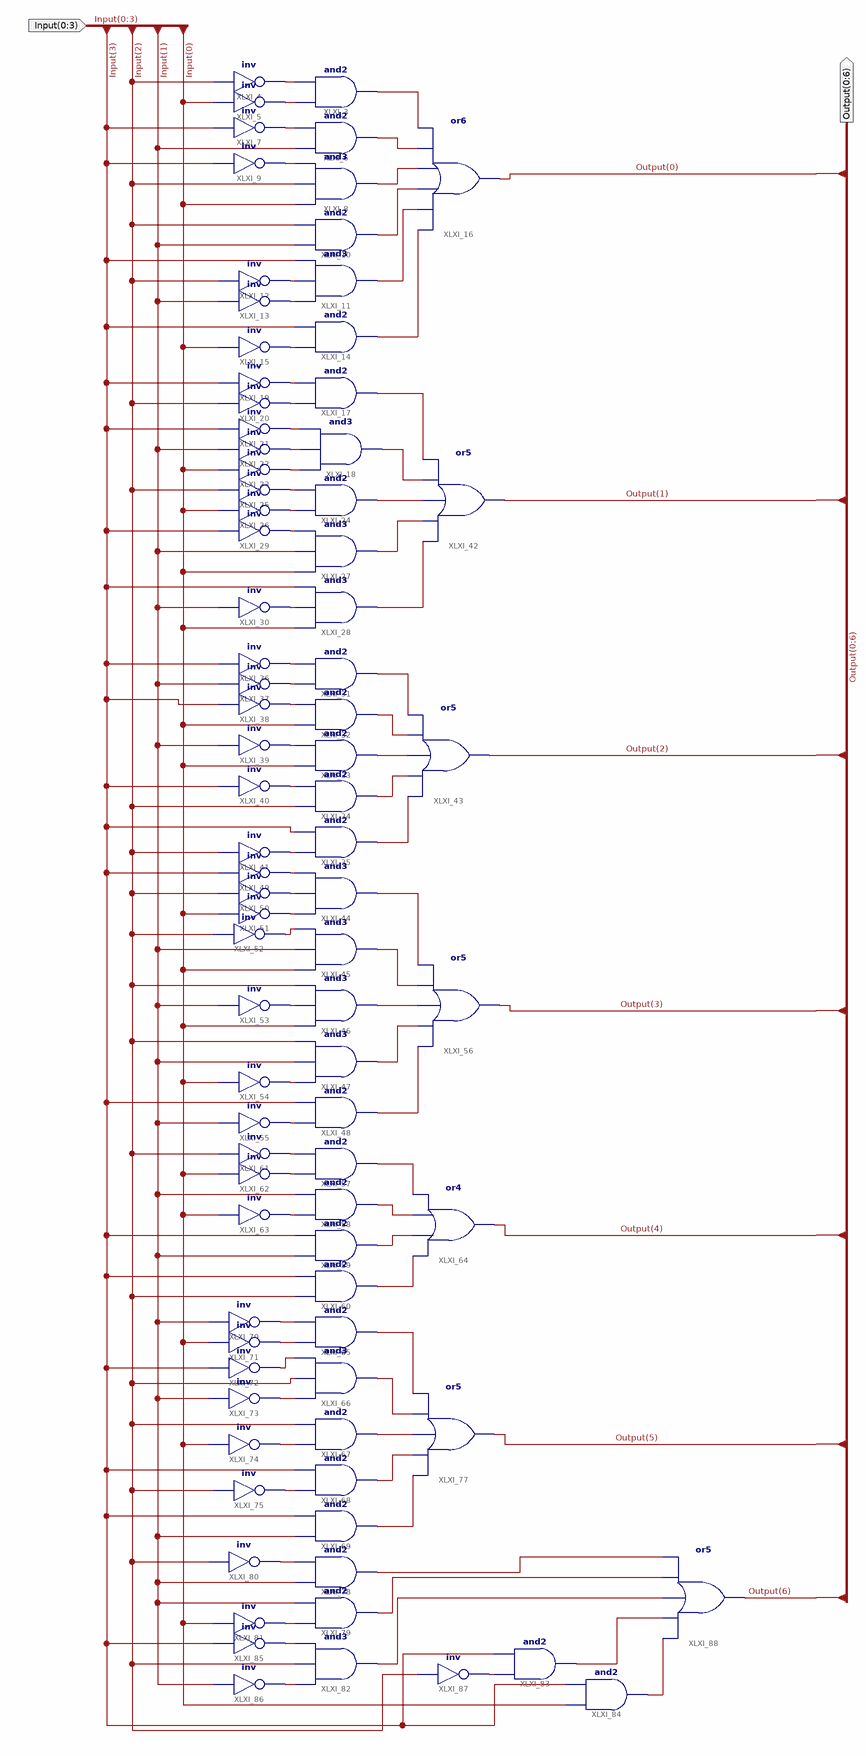
[diagram p0: schematic sheet 1]
// Xilinx ISE schematic decodeTosegment.sch (spartan6) as structural Verilog: 85 symbols, 2 ports
module decodeTosegment (
  input  [0:3] Input,
  output [0:6] Output
);

  wire XLXN_14, XLXN_15, XLXN_16, XLXN_17, XLXN_18, XLXN_19, XLXN_20, XLXN_21, XLXN_22, XLXN_23, XLXN_24,
       XLXN_25, XLXN_26, XLXN_27, XLXN_28, XLXN_29, XLXN_30, XLXN_31, XLXN_33, XLXN_34, XLXN_35, XLXN_36,
       XLXN_37, XLXN_38, XLXN_39, XLXN_40, XLXN_41, XLXN_43, XLXN_44, XLXN_45, XLXN_46, XLXN_47, XLXN_49,
       XLXN_50, XLXN_51, XLXN_52, XLXN_53, XLXN_54, XLXN_55, XLXN_56, XLXN_57, XLXN_58, XLXN_59, XLXN_60,
       XLXN_62, XLXN_63, XLXN_64, XLXN_65, XLXN_66, XLXN_67, XLXN_68, XLXN_69, XLXN_70, XLXN_71, XLXN_72,
       XLXN_73, XLXN_74, XLXN_75, XLXN_76, XLXN_77, XLXN_78, XLXN_79, XLXN_80, XLXN_81, XLXN_82, XLXN_83,
       XLXN_84, XLXN_85, XLXN_86, XLXN_87, XLXN_88, XLXN_89, XLXN_90, XLXN_91, XLXN_92, XLXN_93, XLXN_94,
       XLXN_95;

  and XLXI_3 (XLXN_21, XLXN_15, XLXN_14);
  not XLXI_4 (XLXN_14, Input[2]);
  not XLXI_5 (XLXN_15, Input[0]);
  and XLXI_6 (XLXN_22, Input[1], XLXN_16);
  not XLXI_7 (XLXN_16, Input[3]);
  and XLXI_8 (XLXN_23, Input[0], Input[2], XLXN_17);
  not XLXI_9 (XLXN_17, Input[3]);
  and XLXI_10 (XLXN_24, Input[1], Input[2]);
  and XLXI_11 (XLXN_25, XLXN_19, XLXN_18, Input[3]);
  not XLXI_12 (XLXN_18, Input[2]);
  not XLXI_13 (XLXN_19, Input[1]);
  and XLXI_14 (XLXN_26, XLXN_20, Input[3]);
  not XLXI_15 (XLXN_20, Input[0]);
  or XLXI_16 (Output[0], XLXN_26, XLXN_25, XLXN_24, XLXN_23, XLXN_22, XLXN_21);
  and XLXI_17 (XLXN_33, XLXN_28, XLXN_27);
  and XLXI_18 (XLXN_34, XLXN_31, XLXN_30, XLXN_29);
  not XLXI_19 (XLXN_27, Input[3]);
  not XLXI_20 (XLXN_28, Input[2]);
  not XLXI_21 (XLXN_29, Input[3]);
  not XLXI_22 (XLXN_30, Input[1]);
  not XLXI_23 (XLXN_31, Input[0]);
  and XLXI_24 (XLXN_35, XLXN_39, XLXN_38);
  not XLXI_25 (XLXN_38, Input[2]);
  not XLXI_26 (XLXN_39, Input[0]);
  and XLXI_27 (XLXN_36, Input[0], Input[1], XLXN_40);
  and XLXI_28 (XLXN_37, Input[0], XLXN_41, Input[3]);
  not XLXI_29 (XLXN_40, Input[3]);
  not XLXI_30 (XLXN_41, Input[1]);
  and XLXI_31 (XLXN_43, XLXN_94, XLXN_95);
  and XLXI_32 (XLXN_44, Input[0], XLXN_93);
  and XLXI_33 (XLXN_45, Input[0], XLXN_92);
  and XLXI_34 (XLXN_46, Input[2], XLXN_91);
  and XLXI_35 (XLXN_47, XLXN_90, Input[3]);
  not XLXI_36 (XLXN_95, Input[3]);
  not XLXI_37 (XLXN_94, Input[1]);
  not XLXI_38 (XLXN_93, Input[3]);
  not XLXI_39 (XLXN_92, Input[1]);
  not XLXI_40 (XLXN_91, Input[3]);
  not XLXI_41 (XLXN_90, Input[2]);
  or XLXI_42 (Output[1], XLXN_37, XLXN_36, XLXN_35, XLXN_34, XLXN_33);
  or XLXI_43 (Output[2], XLXN_47, XLXN_46, XLXN_45, XLXN_44, XLXN_43);
  and XLXI_44 (XLXN_53, XLXN_87, XLXN_88, XLXN_89);
  and XLXI_45 (XLXN_54, Input[0], Input[1], XLXN_49);
  and XLXI_46 (XLXN_55, Input[0], XLXN_50, Input[2]);
  and XLXI_47 (XLXN_56, XLXN_51, Input[1], Input[2]);
  and XLXI_48 (XLXN_57, XLXN_52, Input[3]);
  not XLXI_49 (XLXN_89, Input[3]);
  not XLXI_50 (XLXN_88, Input[2]);
  not XLXI_51 (XLXN_87, Input[0]);
  not XLXI_52 (XLXN_49, Input[2]);
  not XLXI_53 (XLXN_50, Input[1]);
  not XLXI_54 (XLXN_51, Input[0]);
  not XLXI_55 (XLXN_52, Input[1]);
  or XLXI_56 (Output[3], XLXN_57, XLXN_56, XLXN_55, XLXN_54, XLXN_53);
  and XLXI_57 (XLXN_62, XLXN_59, XLXN_58);
  and XLXI_58 (XLXN_63, XLXN_60, Input[1]);
  and XLXI_59 (XLXN_64, Input[1], Input[3]);
  and XLXI_60 (XLXN_65, Input[2], Input[3]);
  not XLXI_61 (XLXN_58, Input[2]);
  not XLXI_62 (XLXN_59, Input[0]);
  not XLXI_63 (XLXN_60, Input[0]);
  or XLXI_64 (Output[4], XLXN_65, XLXN_64, XLXN_63, XLXN_62);
  and XLXI_65 (XLXN_72, XLXN_67, XLXN_66);
  and XLXI_66 (XLXN_73, XLXN_69, Input[2], XLXN_68);
  and XLXI_67 (XLXN_74, XLXN_70, Input[2]);
  and XLXI_68 (XLXN_75, XLXN_71, Input[3]);
  and XLXI_69 (XLXN_76, Input[1], Input[3]);
  not XLXI_70 (XLXN_66, Input[1]);
  not XLXI_71 (XLXN_67, Input[0]);
  not XLXI_72 (XLXN_68, Input[3]);
  not XLXI_73 (XLXN_69, Input[1]);
  not XLXI_74 (XLXN_70, Input[0]);
  not XLXI_75 (XLXN_71, Input[2]);
  or XLXI_77 (Output[5], XLXN_76, XLXN_75, XLXN_74, XLXN_73, XLXN_72);
  and XLXI_78 (XLXN_86, Input[1], XLXN_77);
  and XLXI_79 (XLXN_85, XLXN_78, Input[1]);
  not XLXI_80 (XLXN_77, Input[2]);
  not XLXI_81 (XLXN_78, Input[0]);
  and XLXI_82 (XLXN_84, XLXN_80, Input[2], XLXN_79);
  and XLXI_83 (XLXN_83, XLXN_81, Input[3]);
  and XLXI_84 (XLXN_82, Input[0], Input[3]);
  not XLXI_85 (XLXN_79, Input[3]);
  not XLXI_86 (XLXN_80, Input[1]);
  not XLXI_87 (XLXN_81, Input[2]);
  or XLXI_88 (Output[6], XLXN_82, XLXN_83, XLXN_84, XLXN_85, XLXN_86);
endmodule
